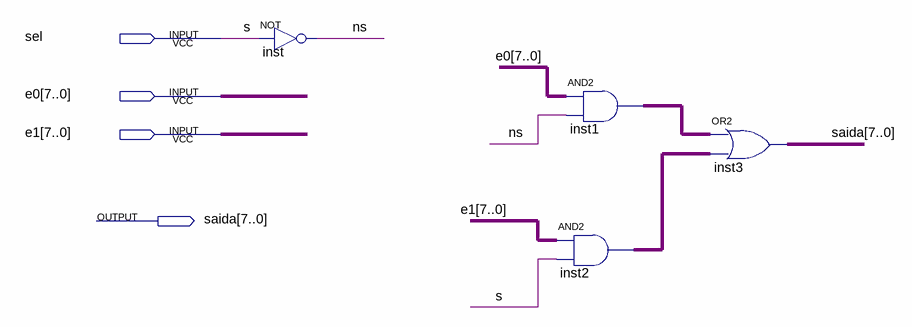
[diagram p0: schematic sheet]
// Quartus schematic mux2to1.bdf as structural Verilog: 4 symbols, 4 pins
module mux2to1 (
  input  sel,
  input  [7:0] e0,
  input  [7:0] e1,
  output [7:0] saida
);

  wire ns;
  wire [7:0] inst1_out, inst2_out;

  not inst (ns, sel);
  assign inst1_out = e0 & {8{ns}};  // AND2 inst1, 8 bits wide
  assign inst2_out = e1 & {8{sel}};  // AND2 inst2, 8 bits wide
  assign saida = inst1_out | inst2_out;  // OR2 inst3, 8 bits wide

  // Other names for the same wires on the sheet: s = sel
endmodule
